# EAGLE design ADC (EAGLE 6.3)
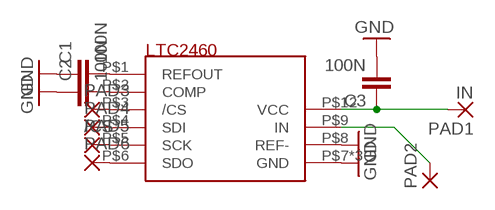
[diagram p0: schematic, sheet 1]

## Parts
C1  100N  C-EUC0805  [C0805]
C2  100N  C-EUC0805  [C0805]
C3  100N  C-EUC0805  [C0805]
PAD1  IN  2,54/0,8  [2,54/0,8]
PAD2  2,54/0,8  [2,54/0,8]
PAD3  /CS  2,54/0,8  [2,54/0,8]
PAD4  2,54/0,8  [2,54/0,8]
PAD5  2,54/0,8  [2,54/0,8]
PAD6  2,54/0,8  [2,54/0,8]
U$1  LTC2460  [MSOP8_LT]

## Nets
GND: C1.1 C2.1 C3.2 U$1.P$7(GND) U$1.P$8(REF-) U$1.P$10(GND) U$1.P$11(GND)
N$1: C1.2 U$1.P$1(REFOUT)
N$2: C2.2 U$1.P$2(COMP)
N$3: C3.1 PAD1.1(P) U$1.P$12(VCC)
N$4: PAD2.1(P) U$1.P$9(IN)
N$5: PAD3.1(P) U$1.P$3(/CS)
N$6: PAD4.1(P) U$1.P$4(SDI)
N$7: PAD5.1(P) U$1.P$5(SCK)
N$8: PAD6.1(P) U$1.P$6(SDO)

## Library data of the parts
C1-C3 = rcl:C-EU: CAPACITOR, European symbol
PAD1-PAD6 = wirepad:2,54/0,8: THROUGH-HOLE PAD
U$1 = ref-packages:LTC2460

## Net classes
0 default: clearance 0.6 mm

## Board
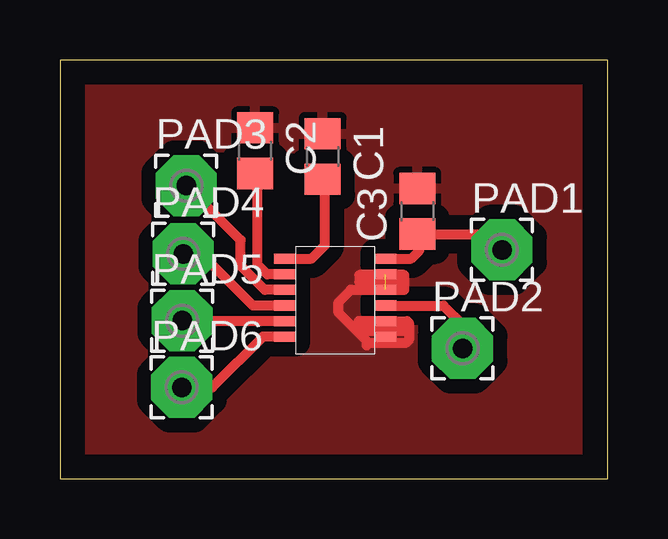
[diagram p1: board, top side]

Size 22.84 x 17.45 mm. Coordinates in mm from the lower left corner, seen from the top.
Outline: 0,0 22.84,0 22.84,17.45 0,17.45 0,0
Copper layers (1*16): Top 0.035mm / dielectric 1.5mm / Bottom 0.035mm
Design rules "default": minimum track width 10mil, minimum drill 24mil, track to track 8mil, track to pad 8mil, pad to pad 8mil, via to via 8mil, smd to smd 8mil, copper to edge 40mil, drill to drill 8mil, minimum pad ring 10mil, minimum via ring 8mil, stop-mask expansion 4mil, vias tented up to drill 0mil, thermal gap 10mil

### Footprints (pad centres in the part's own frame; a part is rotated, then mirrored left to right if it is on the bottom)
C0805 = smd 1.3 x 1.5: 1 -0.95,0; 2 0.95,0
2,54/0,8 = drill 0.813 pad 2.54 octagon: 1 0,0
MSOP8_LT = smd 0.9 x 0.42: P$1 -2.05,1.55; P$2 -2.05,0.9; P$3 -2.05,0.25; P$4 -2.05,-0.4; P$5 -2.05,-1.05; P$6 -2.05,-1.7; P$7 2.15,-1.7; P$8 2.15,-1.05; P$9 2.15,-0.4; P$10 2.15,0.25; P$11 2.15,0.9; P$12 2.15,1.55

### Placement (x,y rotation side)
C1  10.96,13.43 270 top
C2  8.14,13.67 270 top
C3  14.9,11.15 90 top
PAD1  18.43,9.54 0 top
PAD2  16.79,5.43 0 top
PAD3  5.27,12.21 0 top
PAD4  5.14,9.37 0 top
PAD5  5.1,6.59 0 top
PAD6  5.08,3.81 0 top
U$1  11.43,7.62 0 top

### Tracks (layer width: path | path; a pad name or v marks a point on that pad's centre or on a via)
GND  (1 unrouted)
  Top 0.406: 14.44,6.25 14.36,6.17 12.71,6.17 12.45,6.43 12.45,6.58 12.47,6.57 U$1.P$8 14.48,6.57 14.54,6.51 14.54,5.77 14.42,5.65 12.88,5.65 12.8,5.56 12.8,5.74 11.62,6.92 11.62,7.37 12.13,7.88 13.57,7.88 U$1.P$10 14.35,7.87 14.36,7.86 14.36,8.49 14.35,8.5 12.48,8.5 12.48,8.2 12.53,8.15 14.1,8.15 14.11,8.16
  pour Top: -2.54,0 21.59,0 21.59,17.78 -2.54,17.78
N$1
  Top 0.406: U$1.P$1 10.49,9.17 11.05,9.73 11.05,12.39 C1.2
N$2
  Top 0.406: U$1.P$2 8.64,8.52 8.25,8.91 8.25,12.61 C2.2
N$3
  Top 0.305: 17.78,10.2 PAD1.1
  Top 0.406: 17.78,10.2 C3.1 14.99,10.12 14.99,9.51 14.65,9.17 U$1.P$12
N$4
  Top 0.406: U$1.P$9 15.99,7.22 16.82,6.39 16.82,5.47 PAD2.1
N$5
  Top 0.406: U$1.P$3 8.53,7.87 7.53,8.87 7.53,9.95 PAD3.1
N$6
  Top 0.406: U$1.P$4 8.05,7.22 5.99,9.28 5.23,9.28 PAD4.1
N$7
  Top 0.406: U$1.P$5 5.12,6.57 PAD5.1
N$8
  Top 0.406: U$1.P$6 8.46,5.92 6.35,3.81 PAD6.1